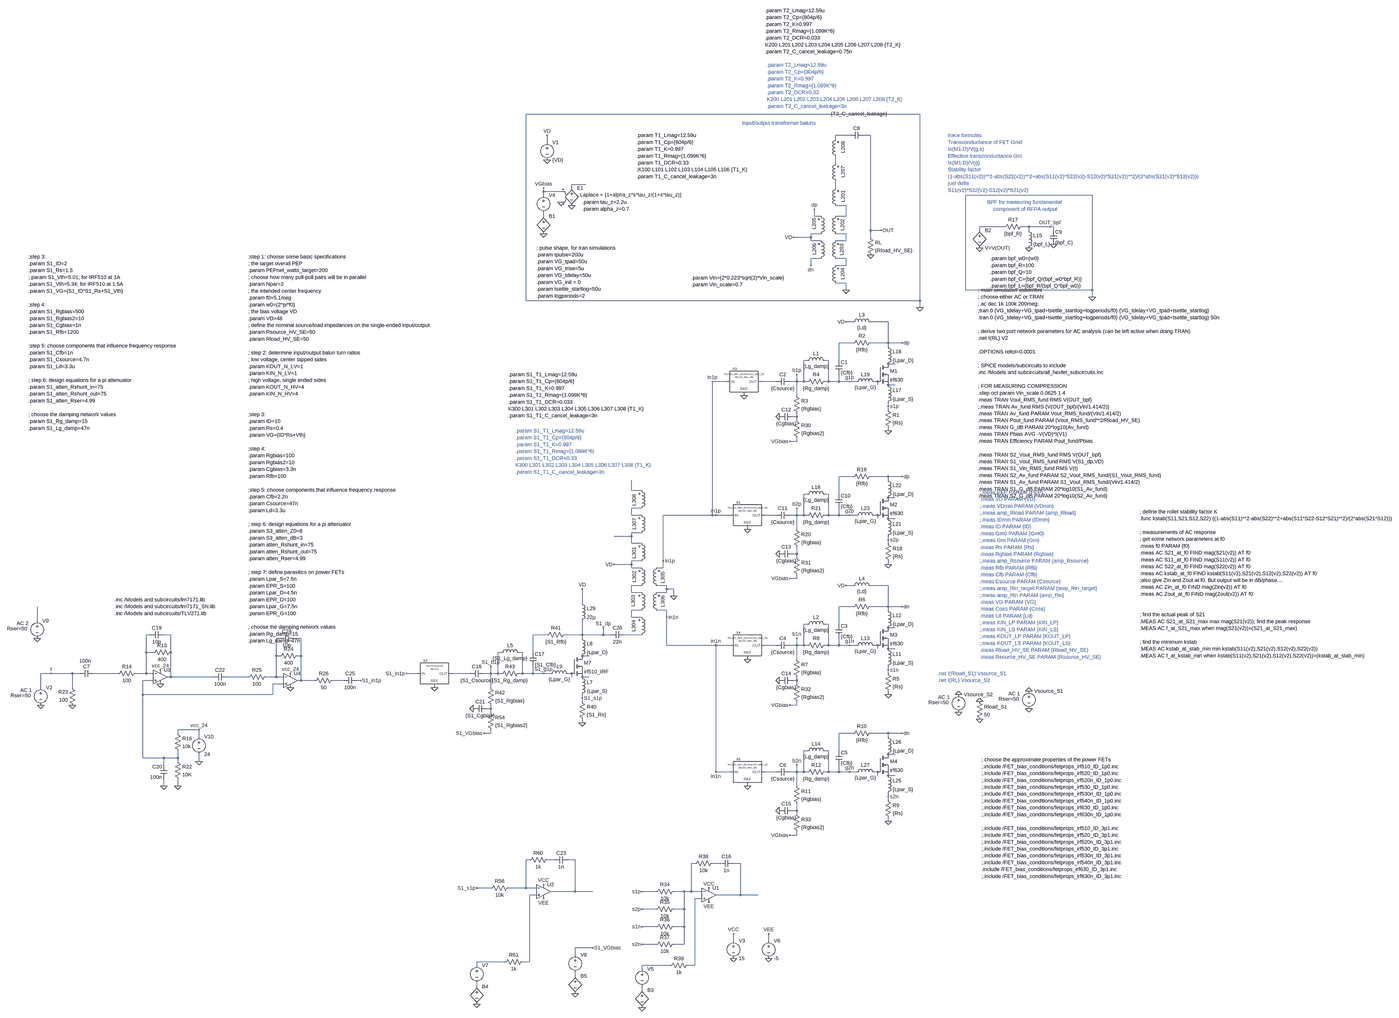
[diagram p0: schematic Easy_RFPA_RevC_seS1_500W.asc, whole sheet]
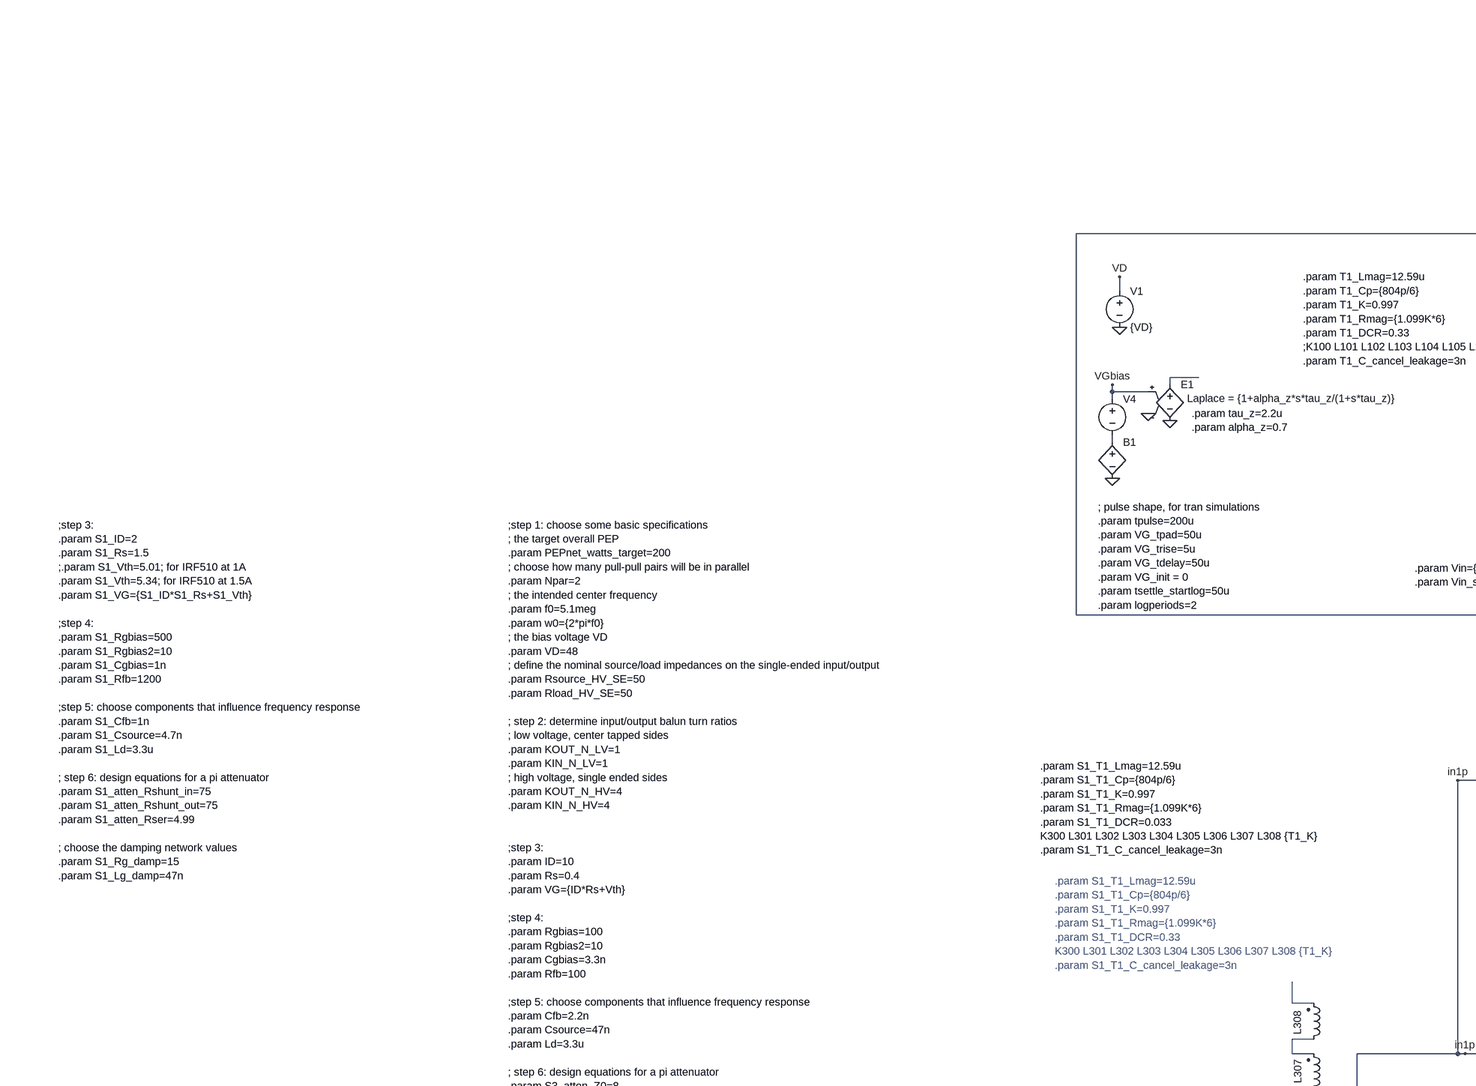
[diagram p1: schematic Easy_RFPA_RevC_seS1_500W.asc, part, row 1 of 2, column 1 of 2]
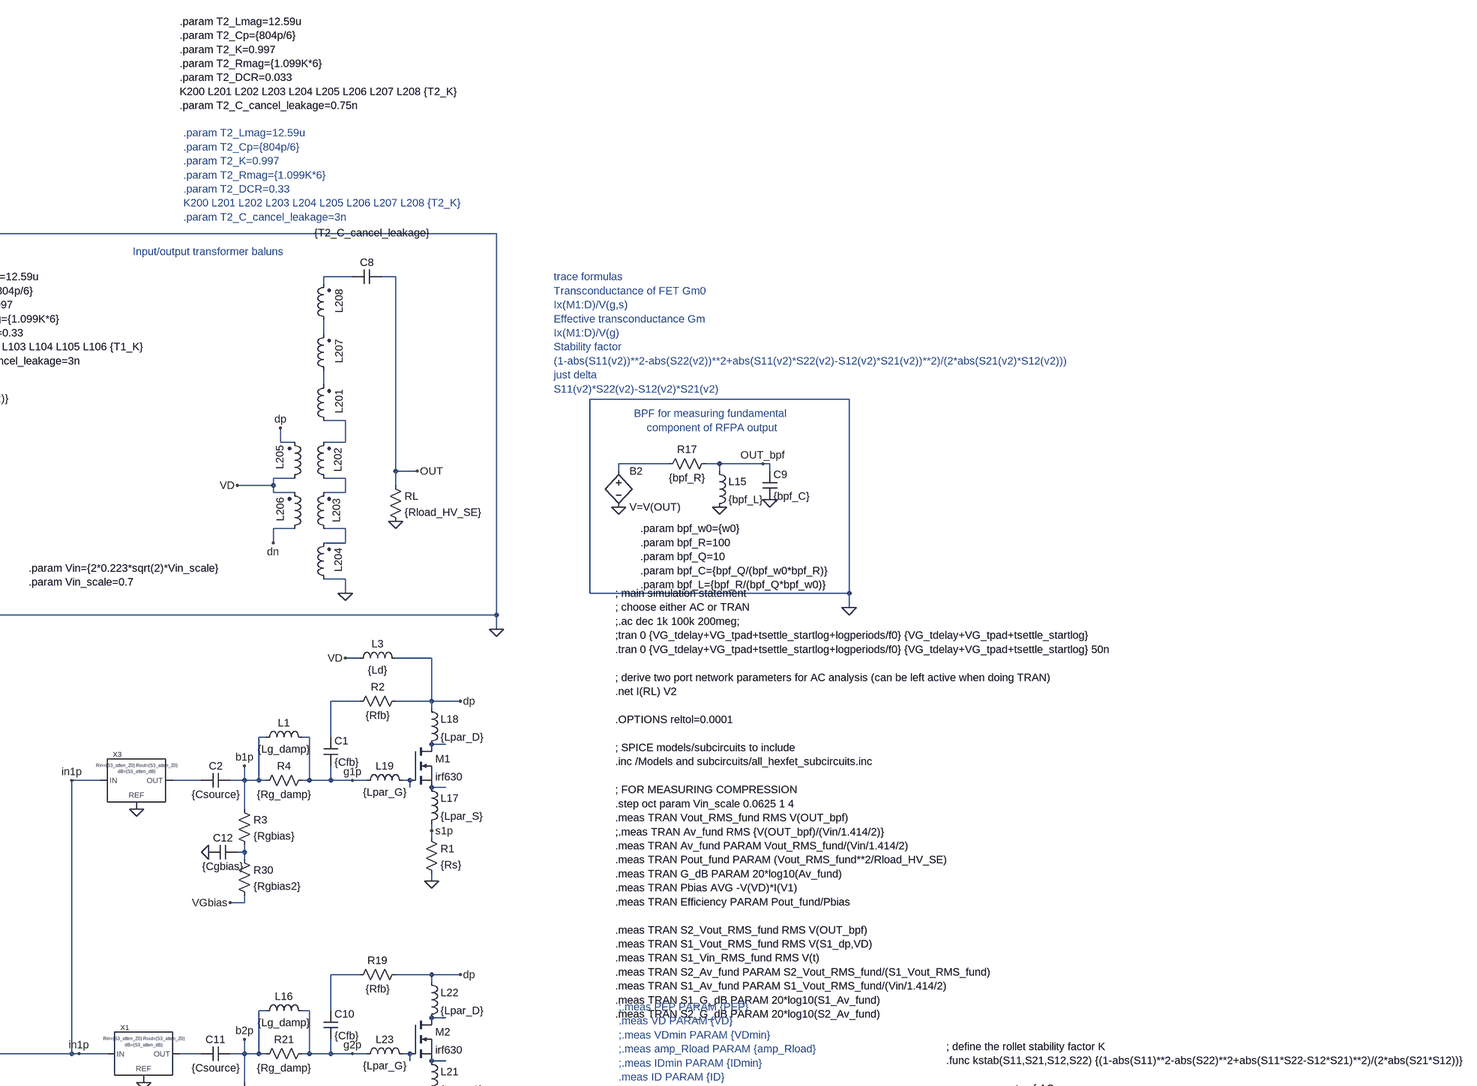
[diagram p2: schematic Easy_RFPA_RevC_seS1_500W.asc, part, row 1 of 2, column 2 of 2]
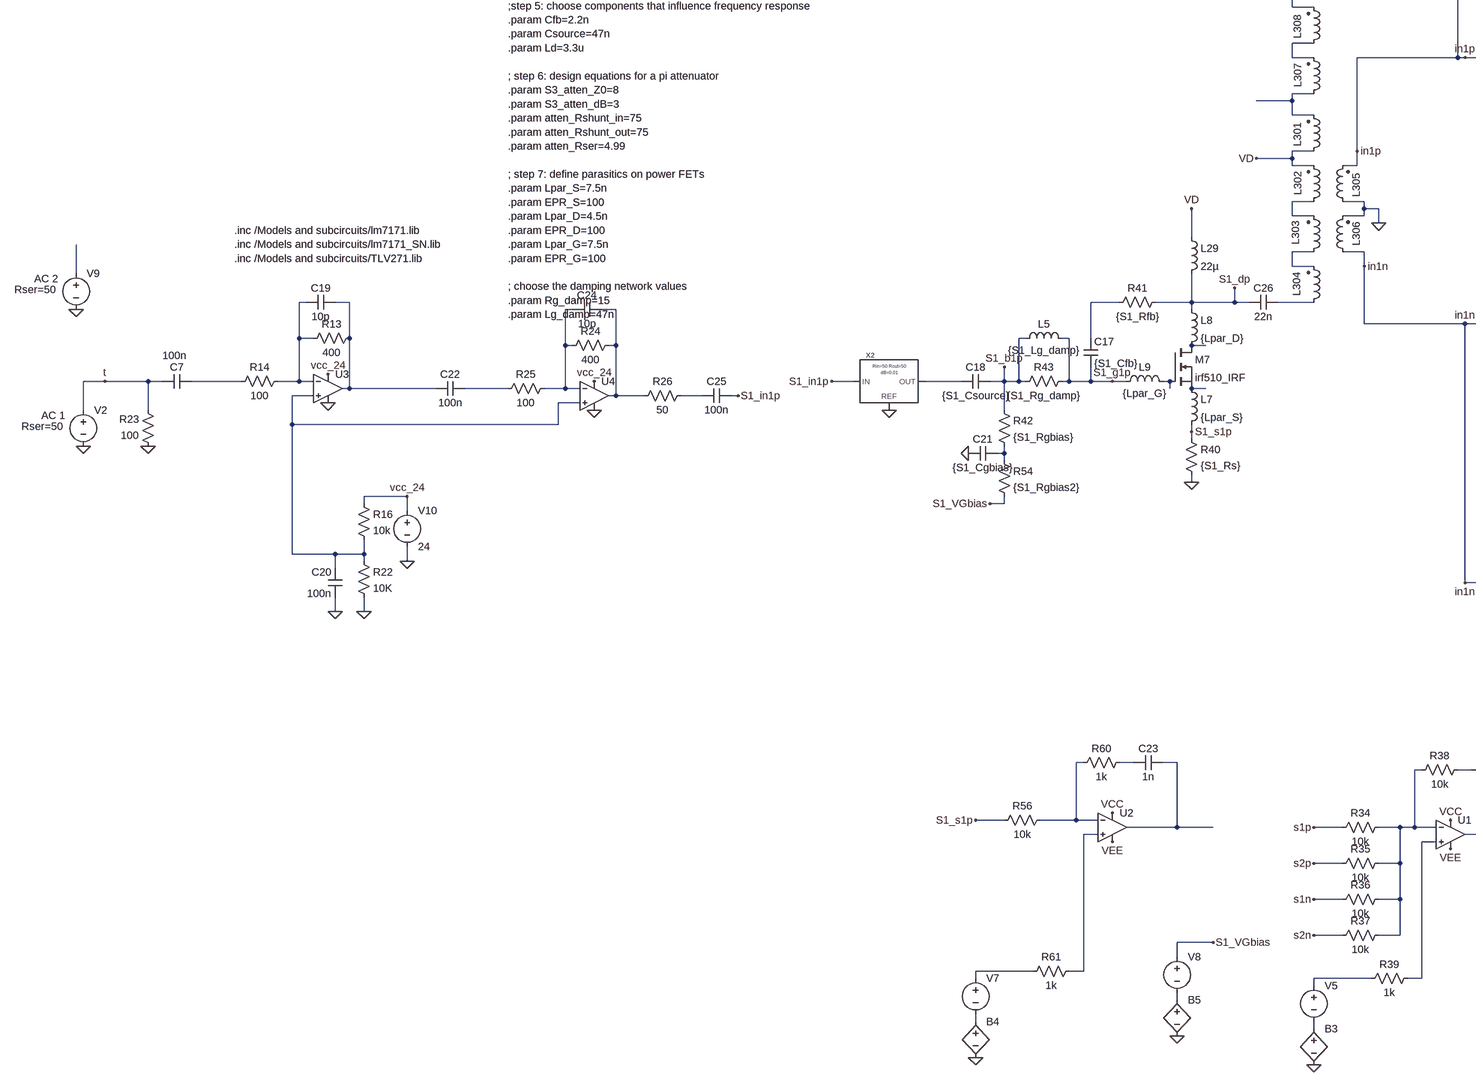
[diagram p3: schematic Easy_RFPA_RevC_seS1_500W.asc, part, row 2 of 2, column 1 of 2]
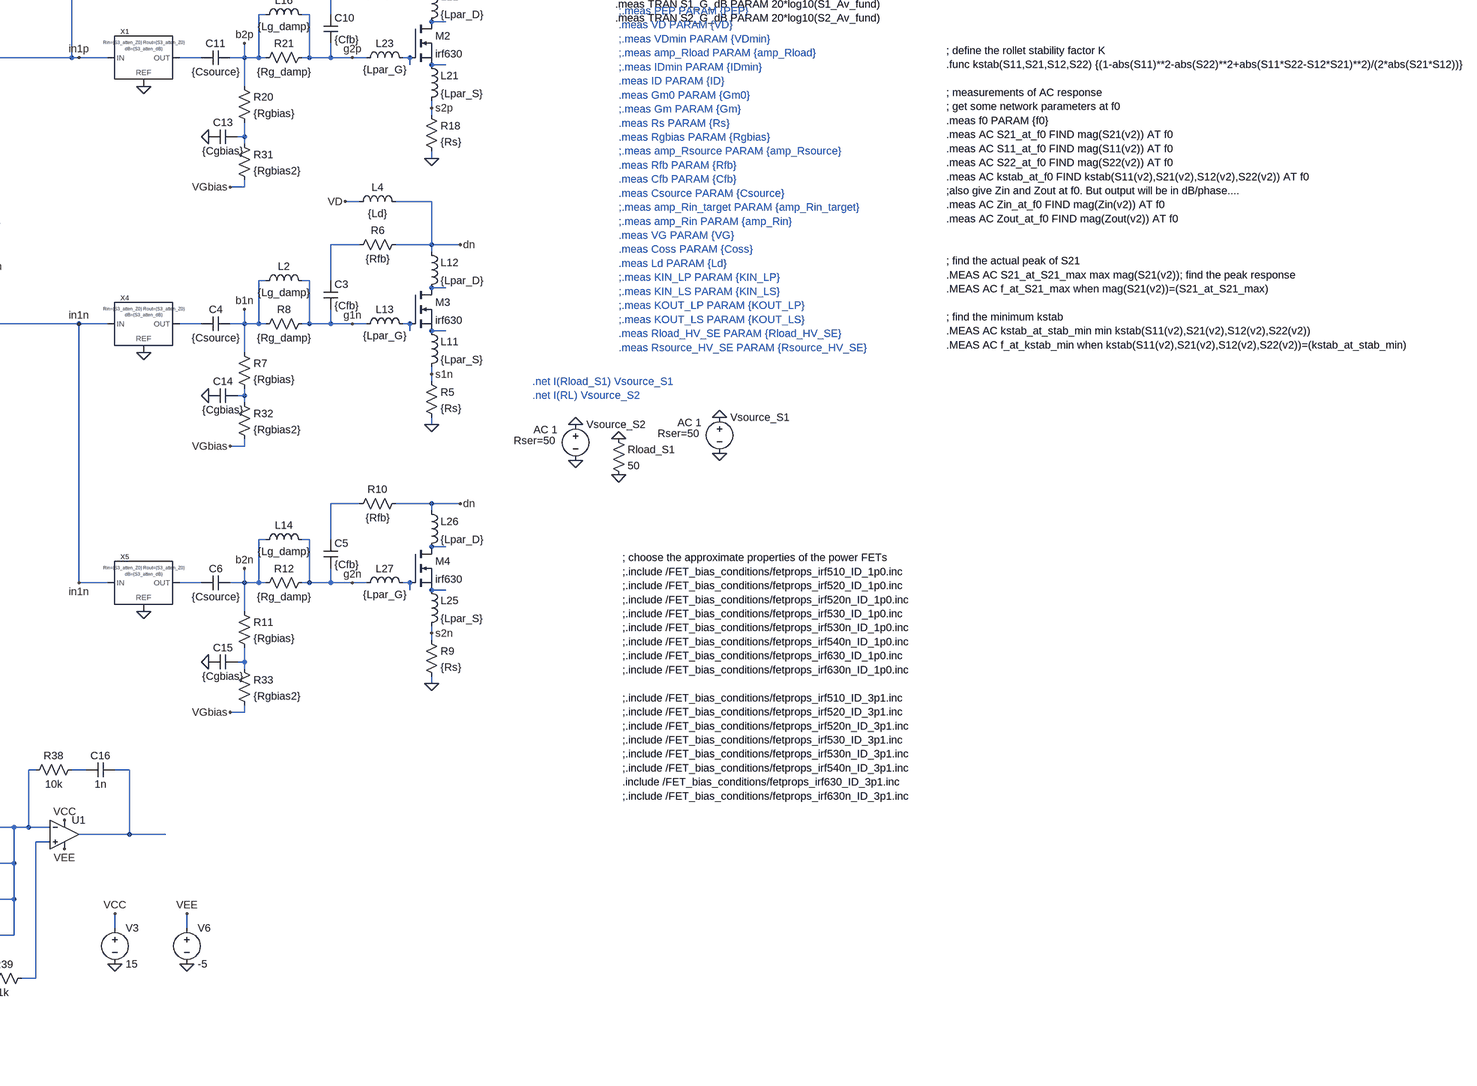
[diagram p4: schematic Easy_RFPA_RevC_seS1_500W.asc, part, row 2 of 2, column 2 of 2]
* Easy_RFPA_RevC_seS1_500W.asc
R1 s1p 0 {Rs}
R2 dp N010 {Rfb}
C1 N010 g1p {Cfb}
R3 b1p N015 {Rgbias}
R4 g1p b1p {Rg_damp}
L1 b1p g1p {Lg_damp}
C2 N012 b1p {Csource}
V1 VD 0 {VD}
L3 VD dp {Ld}
RL OUT 0 {Rload_HV_SE}
V4 VGbias N006 PULSE({VG_init} {VG} {VG_tdelay} {VG_trise} {VG_trise} {VG_tpad*2+tpulse-VG_trise} 10m)
V2 t 0 SINE(0 {Vin} {f0} {VG_tdelay+VG_tpad} 0 0 {tpulse*f0}) AC 1 Rser=50
B1 N006 0 V=VG*smallsig()
B2 N007 0 V=V(OUT)
R17 OUT_bpf N007 {bpf_R}
L15 OUT_bpf 0 {bpf_L}
C9 OUT_bpf 0 {bpf_C}
XM1 N011 N013 N014 irf630  ; pins D G S
L17 N014 s1p {Lpar_S} Rpar={EPR_S}
L18 dp N011 {Lpar_D} Rpar={EPR_D}
L19 g1p N013 {Lpar_G} Rpar={EPR_G}
R18 s2p 0 {Rs}
R19 dp N016 {Rfb}
C10 N016 g2p {Cfb}
R20 b2p N024 {Rgbias}
R21 g2p b2p {Rg_damp}
L16 b2p g2p {Lg_damp}
C11 b2p N020 {Csource}
XM2 N018 N021 N022 irf630  ; pins D G S
L21 N022 s2p {Lpar_S} Rpar={EPR_S}
L22 dp N018 {Lpar_D} Rpar={EPR_D}
L23 g2p N021 {Lpar_G} Rpar={EPR_G}
R5 s1n 0 {Rs}
R6 dn N026 {Rfb}
C3 N026 g1n {Cfb}
R7 b1n N047 {Rgbias}
R8 g1n b1n {Rg_damp}
L2 b1n g1n {Lg_damp}
C4 b1n N036 {Csource}
L4 VD dn {Ld}
XM3 N029 N037 N038 irf630  ; pins D G S
L11 N038 s1n {Lpar_S} Rpar={EPR_S}
L12 dn N029 {Lpar_D} Rpar={EPR_D}
L13 g1n N037 {Lpar_G} Rpar={EPR_G}
R9 s2n 0 {Rs}
R10 dn N049 {Rfb}
C5 N049 g2n {Cfb}
R11 b2n N054 {Rgbias}
R12 g2n b2n {Rg_damp}
L14 b2n g2n {Lg_damp}
C6 b2n N051 {Csource}
XM4 N050 N052 N053 irf630  ; pins D G S
L25 N053 s2n {Lpar_S} Rpar={EPR_S}
L26 dn N050 {Lpar_D} Rpar={EPR_D}
L27 g2n N052 {Lpar_G} Rpar={EPR_G}
C7 t N040 100n
L204 0 N009 {T2_Lmag} Rser={T2_DCR} Rpar={T2_Rmag} Cpar={T2_Cp}
L203 N009 N008 {T2_Lmag} Rser={T2_DCR} Rpar={T2_Rmag} Cpar={T2_Cp}
L202 N008 N005 {T2_Lmag} Rser={T2_DCR} Rpar={T2_Rmag} Cpar={T2_Cp}
L201 N005 N004 {T2_Lmag} Rser={T2_DCR} Rpar={T2_Rmag} Cpar={T2_Cp}
L206 dn VD {T2_Lmag} Rser={T2_DCR} Rpar={T2_Rmag} Cpar={T2_Cp}
L205 VD dp {T2_Lmag} Rser={T2_DCR} Rpar={T2_Rmag} Cpar={T2_Cp}
C8 OUT N001 {T2_C_cancel_leakage}
R30 N015 VGbias {Rgbias2}
C12 N015 0 {Cgbias}
R31 N024 VGbias {Rgbias2}
C13 N024 0 {Cgbias}
R32 N047 VGbias {Rgbias2}
C14 N047 0 {Cgbias}
R33 N054 VGbias {Rgbias2}
C15 N054 0 {Cgbias}
E1 N003 0 VGbias 0 Laplace = {1+alpha_z*s*tau_z/(1+s*tau_z)}
XU1 N062 N058 VCC VEE N060 level.2 Avol=1Meg GBW=50Meg Slew=10Meg ilimit=1 rail=0 Vos=0 phimargin=45 en=0 enk=0 in=0 ink=0 Rin=500Meg  ; pins IN+ IN- V+ V- OUT
V3 VCC 0 15
R34 N058 s1p 10k
R35 N058 s2p 10k
R36 N058 s1n 10k
R37 N058 s2n 10k
V5 N064 N067 PULSE(0.001 {ID*Rs} {VG_tdelay} {VG_trise} {VG_trise} {VG_tpad*2+tpulse-VG_trise} 10m)
B3 N067 0 V=ID*Rs*smallsig()
R38 N059 N058 10k
R39 N062 N064 1k
C16 N060 N059 1n
V6 VEE 0 -5
R40 S1_s1p 0 {S1_Rs}
R41 S1_dp N032 {S1_Rfb}
C17 N032 S1_g1p {S1_Cfb}
R42 S1_b1p N048 {S1_Rgbias}
R43 S1_g1p S1_b1p {S1_Rg_damp}
L5 S1_b1p S1_g1p {S1_Lg_damp}
C18 N041 S1_b1p {S1_Csource}
L7 N044 S1_s1p {Lpar_S} Rpar={EPR_S}
L8 S1_dp N039 {Lpar_D} Rpar={EPR_D}
L9 S1_g1p N042 {Lpar_G} Rpar={EPR_G}
R54 N048 S1_VGbias {S1_Rgbias2}
C21 N048 0 {S1_Cgbias}
L304 N033 N027 {S1_T1_Lmag} Rser={S1_T1_DCR} Rpar={S1_T1_Rmag} Cpar={S1_T1_Cp}
L303 N027 N025 {S1_T1_Lmag} Rser={S1_T1_DCR} Rpar={S1_T1_Rmag} Cpar={S1_T1_Cp}
L302 N025 VD {S1_T1_Lmag} Rser={S1_T1_DCR} Rpar={S1_T1_Rmag} Cpar={S1_T1_Cp}
L301 VD N023 {S1_T1_Lmag} Rser={S1_T1_DCR} Rpar={S1_T1_Rmag} Cpar={S1_T1_Cp}
L306 in1n 0 {S1_T1_Lmag} Rser={S1_T1_DCR} Rpar={S1_T1_Rmag} Cpar={S1_T1_Cp}
L305 0 in1p {S1_T1_Lmag} Rser={S1_T1_DCR} Rpar={S1_T1_Rmag} Cpar={S1_T1_Cp}
XU2 N061 N055 VCC VEE N057 level.2 Avol=1Meg GBW=50Meg Slew=10Meg ilimit=1 rail=0 Vos=0 phimargin=45 en=0 enk=0 in=0 ink=0 Rin=500Meg  ; pins IN+ IN- V+ V- OUT
R56 N055 S1_s1p 10k
V7 N063 N066 PULSE(0.001 {S1_ID*S1_Rs} {VG_tdelay} {VG_trise} {VG_trise} {VG_tpad*2+tpulse-VG_trise} 10m)
B4 N066 0 V=S1_ID*S1_Rs*smallsig()
R60 N056 N055 1k
R61 N061 N063 1k
C23 N057 N056 1n
L29 VD S1_dp 22µ
XM7 N039 N042 N044 irf510_IRF  ; pins D G S
Rload_S1 0 0 50
V8 S1_VGbias N065 PULSE({VG_init} {S1_VG} {VG_tdelay} {VG_trise} {VG_trise} {VG_tpad*2+tpulse-VG_trise} 10m)
B5 N065 0 V=S1_VG*smallsig()
Vsource_S1 0 0 0 AC 1 Rser=50
Vsource_S2 0 0 0 AC 1 Rser=50
XX3 in1p N012 0 atten Rin={S3_atten_Z0} Rout={S3_atten_Z0} dB={S3_atten_dB}  ; pins IN OUT REF
XX1 in1p N020 0 atten Rin={S3_atten_Z0} Rout={S3_atten_Z0} dB={S3_atten_dB}  ; pins IN OUT REF
XX4 in1n N036 0 atten Rin={S3_atten_Z0} Rout={S3_atten_Z0} dB={S3_atten_dB}  ; pins IN OUT REF
XX5 in1n N051 0 atten Rin={S3_atten_Z0} Rout={S3_atten_Z0} dB={S3_atten_dB}  ; pins IN OUT REF
XX2 S1_in1p N041 0 atten Rin=50 Rout=50 dB=0.01  ; pins IN OUT REF
V10 vcc_24 0 24
R13 N031 N030 400
R14 N030 N040 100
C19 N031 N030 10p
R16 vcc_24 N045 10k
R22 N045 0 10K
C20 0 N045 100n
C22 N043 N031 100n
R23 0 t 100
XU3 N045 N030 vcc_24 0 N031 level.2 Avol=5.6K GBW=160Meg Slew=100Meg ilimit=120m rail=0 Vos=0 phimargin=45 en=0 enk=0 in=0 ink=0 Rin=500Meg  ; pins IN+ IN- V+ V- OUT
V9 N028 0 SINE(0 {Vin} {f0} {VG_tdelay+VG_tpad} 0 0 {tpulse*f0}) AC 2 Rser=50
R24 N035 N034 400
R25 N034 N043 100
R26 N046 N035 50
C24 N035 N034 10p
C25 S1_in1p N046 100n
XU4 N045 N034 vcc_24 0 N035 level.2 Avol=5.6K GBW=160Meg Slew=100Meg ilimit=120m rail=0 Vos=0 phimargin=45 en=0 enk=0 in=0 ink=0 Rin=500Meg  ; pins IN+ IN- V+ V- OUT
C26 N033 S1_dp 22n
L207 N004 N002 {T2_Lmag} Rser={T2_DCR} Rpar={T2_Rmag} Cpar={T2_Cp}
L208 N002 N001 {T2_Lmag} Rser={T2_DCR} Rpar={T2_Rmag} Cpar={T2_Cp}
L307 N023 N019 {S1_T1_Lmag} Rser={S1_T1_DCR} Rpar={S1_T1_Rmag} Cpar={S1_T1_Cp}
L308 N019 N017 {S1_T1_Lmag} Rser={S1_T1_DCR} Rpar={S1_T1_Rmag} Cpar={S1_T1_Cp}
; main simulation statement
; choose either AC or TRAN
;.ac dec 1k 100k 200meg;
;tran 0 {VG_tdelay+VG_tpad+tsettle_startlog+logperiods/f0} {VG_tdelay+VG_tpad+tsettle_startlog}
.tran 0 {VG_tdelay+VG_tpad+tsettle_startlog+logperiods/f0} {VG_tdelay+VG_tpad+tsettle_startlog} 50n
; derive two port network parameters for AC analysis (can be left active when doing TRAN)
.net I(RL) V2
.OPTIONS reltol=0.0001
; SPICE models/subcircuits to include
.inc /Models and subcircuits/all_hexfet_subcircuits.inc
; FOR MEASURING COMPRESSION
.step oct param Vin_scale 0.0625 1 4
.meas TRAN Vout_RMS_fund RMS V(OUT_bpf)
;.meas TRAN Av_fund RMS {V(OUT_bpf)/(Vin/1.414/2)}
.meas TRAN Av_fund PARAM Vout_RMS_fund/(Vin/1.414/2)
.meas TRAN Pout_fund PARAM (Vout_RMS_fund**2/Rload_HV_SE)
.meas TRAN G_dB PARAM 20*log10(Av_fund)
.meas TRAN Pbias AVG -V(VD)*I(V1)
.meas TRAN Efficiency PARAM Pout_fund/Pbias
.meas TRAN S2_Vout_RMS_fund RMS V(OUT_bpf)
.meas TRAN S1_Vout_RMS_fund RMS V(S1_dp,VD)
.meas TRAN S1_Vin_RMS_fund RMS V(t)
.meas TRAN S2_Av_fund PARAM S2_Vout_RMS_fund/(S1_Vout_RMS_fund)
.meas TRAN S1_Av_fund PARAM S1_Vout_RMS_fund/(Vin/1.414/2)
.meas TRAN S1_G_dB PARAM 20*log10(S1_Av_fund)
.meas TRAN S2_G_dB PARAM 20*log10(S2_Av_fund)
* trace formulas
* Transconductance of FET Gm0
* Ix(M1:D)/V(g,s)
* Effective transconductance Gm
* Ix(M1:D)/V(g)
* Stability factor
* (1-abs(S11(v2))**2-abs(S22(v2))**2+abs(S11(v2)*S22(v2)-S12(v2)*S21(v2))**2)/(2*abs(S21(v2)*S12(v2)))
* just delta
* S11(v2)*S22(v2)-S12(v2)*S21(v2)
;step 1: choose some basic specifications
; the target overall PEP
.param PEPnet_watts_target=200
; choose how many pull-pull pairs will be in parallel
.param Npar=2
; the intended center frequency
.param f0=5.1meg
.param w0={2*pi*f0}
; the bias voltage VD
.param VD=48
; define the nominal source/load impedances on the single-ended input/output
.param Rsource_HV_SE=50
.param Rload_HV_SE=50
; step 2: determine input/output balun turn ratios
; low voltage, center tapped sides
.param KOUT_N_LV=1
.param KIN_N_LV=1
; high voltage, single ended sides
.param KOUT_N_HV=4
.param KIN_N_HV=4
;step 3:
.param ID=10
.param Rs=0.4
.param VG={ID*Rs+Vth}
;step 4:
.param Rgbias=100
.param Rgbias2=10
.param Cgbias=3.3n
.param Rfb=100
;step 5: choose components that influence frequency response
.param Cfb=2.2n
.param Csource=47n
.param Ld=3.3u
; step 6: design equations for a pi attenuator
.param S3_atten_Z0=8
.param S3_atten_dB=3
.param atten_Rshunt_in=75
.param atten_Rshunt_out=75
.param atten_Rser=4.99
; step 7: define parasitics on power FETs
.param Lpar_S=7.5n
.param EPR_S=100
.param Lpar_D=4.5n
.param EPR_D=100
.param Lpar_G=7.5n
.param EPR_G=100
; choose the damping network values
.param Rg_damp=15
.param Lg_damp=47n
* ;.meas PEP PARAM {PEP}
* .meas VD PARAM {VD}
* ;.meas VDmin PARAM {VDmin}
* ;.meas amp_Rload PARAM {amp_Rload}
* ;.meas IDmin PARAM {IDmin}
* .meas ID PARAM {ID}
* .meas Gm0 PARAM {Gm0}
* ;.meas Gm PARAM {Gm}
* .meas Rs PARAM {Rs}
* .meas Rgbias PARAM {Rgbias}
* ;.meas amp_Rsource PARAM {amp_Rsource}
* .meas Rfb PARAM {Rfb}
* .meas Cfb PARAM {Cfb}
* .meas Csource PARAM {Csource}
* ;.meas amp_Rin_target PARAM {amp_Rin_target}
* ;.meas amp_Rin PARAM {amp_Rin}
* .meas VG PARAM {VG}
* .meas Coss PARAM {Coss}
* .meas Ld PARAM {Ld}
* ;.meas KIN_LP PARAM {KIN_LP}
* ;.meas KIN_LS PARAM {KIN_LS}
* ;.meas KOUT_LP PARAM {KOUT_LP}
* ;.meas KOUT_LS PARAM {KOUT_LS}
* .meas Rload_HV_SE PARAM {Rload_HV_SE}
* .meas Rsource_HV_SE PARAM {Rsource_HV_SE}
; pulse shape, for tran simulations
.param tpulse=200u
.param VG_tpad=50u
.param VG_trise=5u
.param VG_tdelay=50u
.param VG_init = 0
.param tsettle_startlog=50u
.param logperiods=2
.param bpf_w0={w0}
.param bpf_R=100
.param bpf_Q=10
.param bpf_C={bpf_Q/(bpf_w0*bpf_R)}
.param bpf_L={bpf_R/(bpf_Q*bpf_w0)}
* BPF for measuring fundamental
* component of RFPA output
* Input/output transformer baluns
; choose the approximate properties of the power FETs
;.include /FET_bias_conditions/fetprops_irf510_ID_1p0.inc
;.include /FET_bias_conditions/fetprops_irf520_ID_1p0.inc
;.include /FET_bias_conditions/fetprops_irf520n_ID_1p0.inc
;.include /FET_bias_conditions/fetprops_irf530_ID_1p0.inc
;.include /FET_bias_conditions/fetprops_irf530n_ID_1p0.inc
;.include /FET_bias_conditions/fetprops_irf540n_ID_1p0.inc
;.include /FET_bias_conditions/fetprops_irf630_ID_1p0.inc
;.include /FET_bias_conditions/fetprops_irf630n_ID_1p0.inc
;.include /FET_bias_conditions/fetprops_irf510_ID_3p1.inc
;.include /FET_bias_conditions/fetprops_irf520_ID_3p1.inc
;.include /FET_bias_conditions/fetprops_irf520n_ID_3p1.inc
;.include /FET_bias_conditions/fetprops_irf530_ID_3p1.inc
;.include /FET_bias_conditions/fetprops_irf530n_ID_3p1.inc
;.include /FET_bias_conditions/fetprops_irf540n_ID_3p1.inc
.include /FET_bias_conditions/fetprops_irf630_ID_3p1.inc
;.include /FET_bias_conditions/fetprops_irf630n_ID_3p1.inc
; define the rollet stability factor K
.func kstab(S11,S21,S12,S22) {(1-abs(S11)**2-abs(S22)**2+abs(S11*S22-S12*S21)**2)/(2*abs(S21*S12))}
; measurements of AC response
; get some network parameters at f0
.meas f0 PARAM {f0}
.meas AC S21_at_f0 FIND mag(S21(v2)) AT f0
.meas AC S11_at_f0 FIND mag(S11(v2)) AT f0
.meas AC S22_at_f0 FIND mag(S22(v2)) AT f0
.meas AC kstab_at_f0 FIND kstab(S11(v2),S21(v2),S12(v2),S22(v2)) AT f0
;also give Zin and Zout at f0. But output will be in dB/phase....
.meas AC Zin_at_f0 FIND mag(Zin(v2)) AT f0
.meas AC Zout_at_f0 FIND mag(Zout(v2)) AT f0
; find the actual peak of S21
.MEAS AC S21_at_S21_max max mag(S21(v2)); find the peak response
.MEAS AC f_at_S21_max when mag(S21(v2))=(S21_at_S21_max)
; find the minimum kstab
.MEAS AC kstab_at_stab_min min kstab(S11(v2),S21(v2),S12(v2),S22(v2))
.MEAS AC f_at_kstab_min when kstab(S11(v2),S21(v2),S12(v2),S22(v2))=(kstab_at_stab_min)
* .param T2_Lmag=12.59u
* .param T2_Cp={804p/6}
* .param T2_K=0.997
* .param T2_Rmag={1.099K*6}
* .param T2_DCR=0.33
* K200 L201 L202 L203 L204 L205 L206 L207 L208 {T2_K}
* .param T2_C_cancel_leakage=3n
.param T1_Lmag=12.59u
.param T1_Cp={804p/6}
.param T1_K=0.997
.param T1_Rmag={1.099K*6}
.param T1_DCR=0.33
;K100 L101 L102 L103 L104 L105 L106 {T1_K}
.param T1_C_cancel_leakage=3n
.param Vin={2*0.223*sqrt(2)*Vin_scale}
.param Vin_scale=0.7
.param tau_z=2.2u
.param alpha_z=0.7
;step 3:
.param S1_ID=2
.param S1_Rs=1.5
;.param S1_Vth=5.01; for IRF510 at 1A
.param S1_Vth=5.34; for IRF510 at 1.5A
.param S1_VG={S1_ID*S1_Rs+S1_Vth}
;step 4:
.param S1_Rgbias=500
.param S1_Rgbias2=10
.param S1_Cgbias=1n
.param S1_Rfb=1200
;step 5: choose components that influence frequency response
.param S1_Cfb=1n
.param S1_Csource=4.7n
.param S1_Ld=3.3u
; step 6: design equations for a pi attenuator
.param S1_atten_Rshunt_in=75
.param S1_atten_Rshunt_out=75
.param S1_atten_Rser=4.99
; choose the damping network values
.param S1_Rg_damp=15
.param S1_Lg_damp=47n
* .param S1_T1_Lmag=12.59u
* .param S1_T1_Cp={804p/6}
* .param S1_T1_K=0.997
* .param S1_T1_Rmag={1.099K*6}
* .param S1_T1_DCR=0.33
* K300 L301 L302 L303 L304 L305 L306 L307 L308 {T1_K}
* .param S1_T1_C_cancel_leakage=3n
* .net I(Rload_S1) Vsource_S1
* .net I(RL) Vsource_S2
.inc /Models and subcircuits/lm7171.lib
.inc /Models and subcircuits/lm7171_SN.lib
.inc /Models and subcircuits/TLV271.lib
.param T2_Lmag=12.59u
.param T2_Cp={804p/6}
.param T2_K=0.997
.param T2_Rmag={1.099K*6}
.param T2_DCR=0.033
K200 L201 L202 L203 L204 L205 L206 L207 L208 {T2_K}
.param T2_C_cancel_leakage=0.75n
.param S1_T1_Lmag=12.59u
.param S1_T1_Cp={804p/6}
.param S1_T1_K=0.997
.param S1_T1_Rmag={1.099K*6}
.param S1_T1_DCR=0.033
K300 L301 L302 L303 L304 L305 L306 L307 L308 {T1_K}
.param S1_T1_C_cancel_leakage=3n
.lib UniversalOpamps2.sub
.backanno
.end